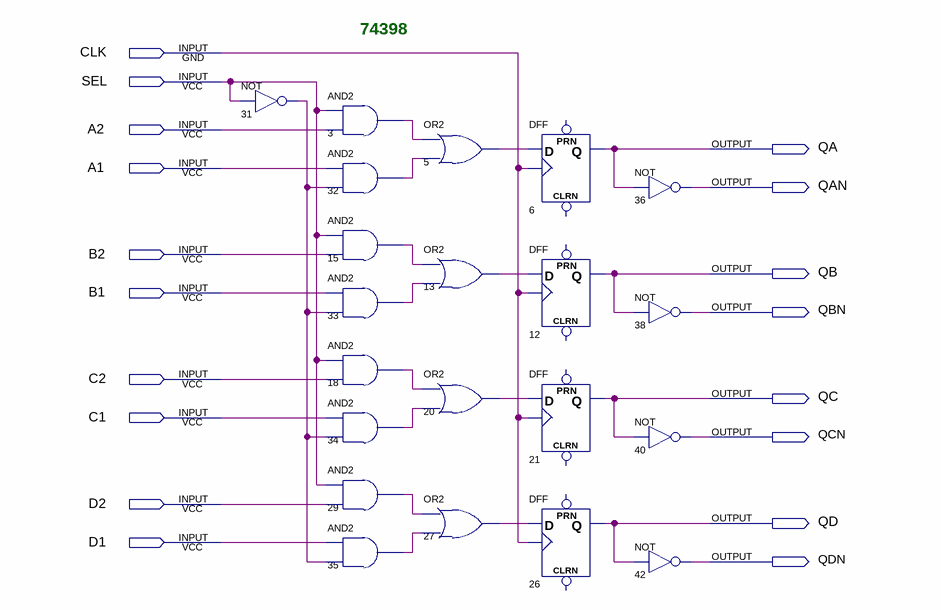
[diagram p0: schematic sheet]
// Quartus schematic 74398.bdf as structural Verilog: 21 symbols, 18 pins
module \74398  (
  input  CLK,
  input  SEL,
  input  A2,
  input  A1,
  input  B2,
  input  B1,
  input  C2,
  input  C1,
  input  D2,
  input  D1,
  output QA,
  output QAN,
  output QB,
  output QBN,
  output QC,
  output QCN,
  output QD,
  output QDN
);

  wire n3_out, n5_out, n13_out, n15_out, n18_out, n20_out, n27_out, n29_out, n31_out, n32_out, n33_out,
       n34_out, n35_out;

  not u_31 (n31_out, SEL);
  and u_3 (n3_out, SEL, A2);
  and u_32 (n32_out, A1, n31_out);
  and u_15 (n15_out, SEL, B2);
  and u_33 (n33_out, B1, n31_out);
  and u_18 (n18_out, SEL, C2);
  and u_34 (n34_out, C1, n31_out);
  and u_29 (n29_out, SEL, D2);
  and u_35 (n35_out, D1, n31_out);
  or u_5 (n5_out, n3_out, n32_out);
  or u_13 (n13_out, n15_out, n33_out);
  or u_20 (n20_out, n18_out, n34_out);
  or u_27 (n27_out, n29_out, n35_out);
  DFF u_6 (.CLK(CLK), .D(n5_out), .Q(QA));  // open: CLRN, PRN
  DFF u_12 (.CLK(CLK), .D(n13_out), .Q(QB));  // open: CLRN, PRN
  DFF u_21 (.CLK(CLK), .D(n20_out), .Q(QC));  // open: CLRN, PRN
  DFF u_26 (.CLK(CLK), .D(n27_out), .Q(QD));  // open: CLRN, PRN
  not u_36 (QAN, QA);
  not u_38 (QBN, QB);
  not u_40 (QCN, QC);
  not u_42 (QDN, QD);

  // Notes on the sheet:
  //   74398
endmodule
